# Altium schematic sheet CM3588.SchDoc: DARKYDEN_CONNECTEUR_1
size Letter; ApprovedBy: APPROUVÉ PAR; Author: Harold Malbrouck; Organization: Cegep Limoilou; Address1: 1300, 8e Avenue; Address2: Québec, QC; Address3: Canada; Address4: G1J 5L5; Revision: Rev.B; SheetNumber: 22; SheetTotal: 23
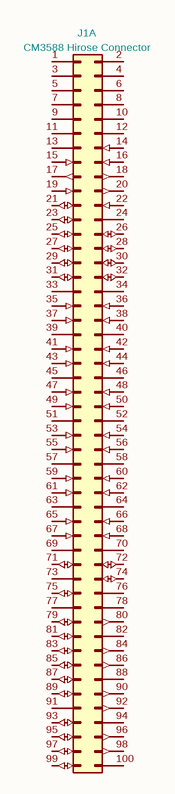
[diagram p0: CM3588.SchDoc]

## Parts
J1  CM3588 Hirose Connector  [CM3588]  (part A of 4)

## Nets

Not connected (* = marked no-connect by the designer): J1 1(VDD_DCIN) 2(VDD_DCIN) 3(VDD_DCIN) 4(VDD_DCIN) 5(VDD_DCIN) 6(VDD_DCIN) 7(VDD_DCIN) 8(VDD_DCIN) 9(VDD_DCIN) 10(VDD_DCIN) 11(GND) 12(GND) 13(GND) 14(SARADC_VIN6_HW_ID2) 15(BOOT_SARADC_IN0) 16(RESET_L) 17(PWRON_L) 18(VDC_MODE) 19(PMIC_EXT_EN_OUT) 20(UART2_TX_M0_DEBUG) 21(GPIO2_C0) 22(UART2_RX_M0_DEBUG) 23(GPIO2_C1/MIPI_CAM2_RESET_L) 24(GND) 25(GPIO2_C2/MIPI_CAM2_PDN_L) 26(GPIO4_C2) 27(GPIO2_C3) 28(GPIO4_C3) 29(GPIO2_C4) 30(GPIO4_C4) 31(GPIO4_C6) 32(GPIO4_C5) 33(GND) 34(GND) 35(MIPI_CSI1_RX_CLK1P) 36(MIPI_CSI0_RX_CLK1P) 37(MIPI_CSI1_RX_CLK1N) 38(MIPI_CSI0_RX_CLK1N) 39(GND) 40(GND) 41(MIPI_CSI1_RX_D3P) 42(MIPI_CSI0_RX_D3P) 43(MIPI_CSI1_RX_D3N) 44(MIPI_CSI0_RX_D3N) 45(GND) 46(GND) 47(MIPI_CSI1_RX_D2P) 48(MIPI_CSI0_RX_D2P) 49(MIPI_CSI1_RX_D2N) 50(MIPI_CSI0_RX_D2N) 51(GND) 52(GND) 53(MIPI_CSI1_RX_CLK0P) 54(MIPI_CSI0_RX_CLK0P) 55(MIPI_CSI1_RX_CLK0N) 56(MIPI_CSI0_RX_CLK0N) 57(GND) 58(GND) 59(MIPI_CSI1_RX_D1P) 60(MIPI_CSI0_RX_D1P) 61(MIPI_CSI1_RX_D1N) 62(MIPI_CSI0_RX_D1N) 63(GND) 64(GND) 65(MIPI_CSI1_RX_D0P) 66(MIPI_CSI0_RX_D0P) 67(MIPI_CSI1_RX_D0N) 68(MIPI_CSI0_RX_D0N) 69(GND) 70(GND) 71(GPIO1_B6) 72(LED3_25GLAN_25GLED) 73(GND) 74(LED2_25GLAN_1GLED) 75(GPIO1_B7) 76(GND) 77(GND) 78(P25G_MDIP0) 79(GPIO2_A6) 80(P25G_MDIN0) 81(GPIO2_A7) 82(GND) 83(GPIO2_B0) 84(P25G_MDIP1) 85(GPIO2_B1_GPIO,) 86(P25G_MDIN1) 87(GPIO2_B2) 88(GND) 89(GPIO2_B3) 90(P25G_MDIP2) 91(GND) 92(P25G_MDIN2) 93(GPIO2_B4) 94(GND) 95(GPIO2_B5) 96(P25G_MDIP3) 97(GPIO2_B6) 98(P25G_MDIN3) 99(GPIO2_B7) 100(GND)

## Notes on the sheet
- Titre :
- Conception :
- Date :
- Approbation :
- Heure :
- Révision :
- Feuille
- de
- Fichier :

## Library data of the parts
J1 = CM3588: LCSC: C597931; Footprint: Library:CM3588; Value: CM3588 Hirose Connector